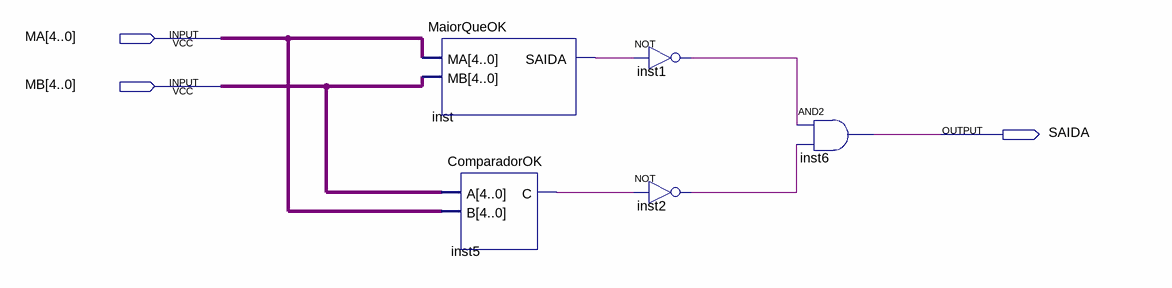
[diagram p0: schematic sheet]
// Quartus schematic MenorQueOK.bdf as structural Verilog: 5 symbols, 3 pins
module MenorQueOK (
  input  [4:0] MA,
  input  [4:0] MB,
  output SAIDA
);

  wire inst1_out, inst2_out, inst5_c, inst_saida;

  MaiorQueOK inst (.MA(MA), .MB(MB), .SAIDA(inst_saida));
  ComparadorOK inst5 (.A(MB), .B(MA), .C(inst5_c));
  not inst1 (inst1_out, inst_saida);
  not inst2 (inst2_out, inst5_c);
  and inst6 (SAIDA, inst1_out, inst2_out);
endmodule
